# Altium schematic sheet USB_FTDI.SchDoc
size A2; SheetNumber: 9; SheetTotal: 14
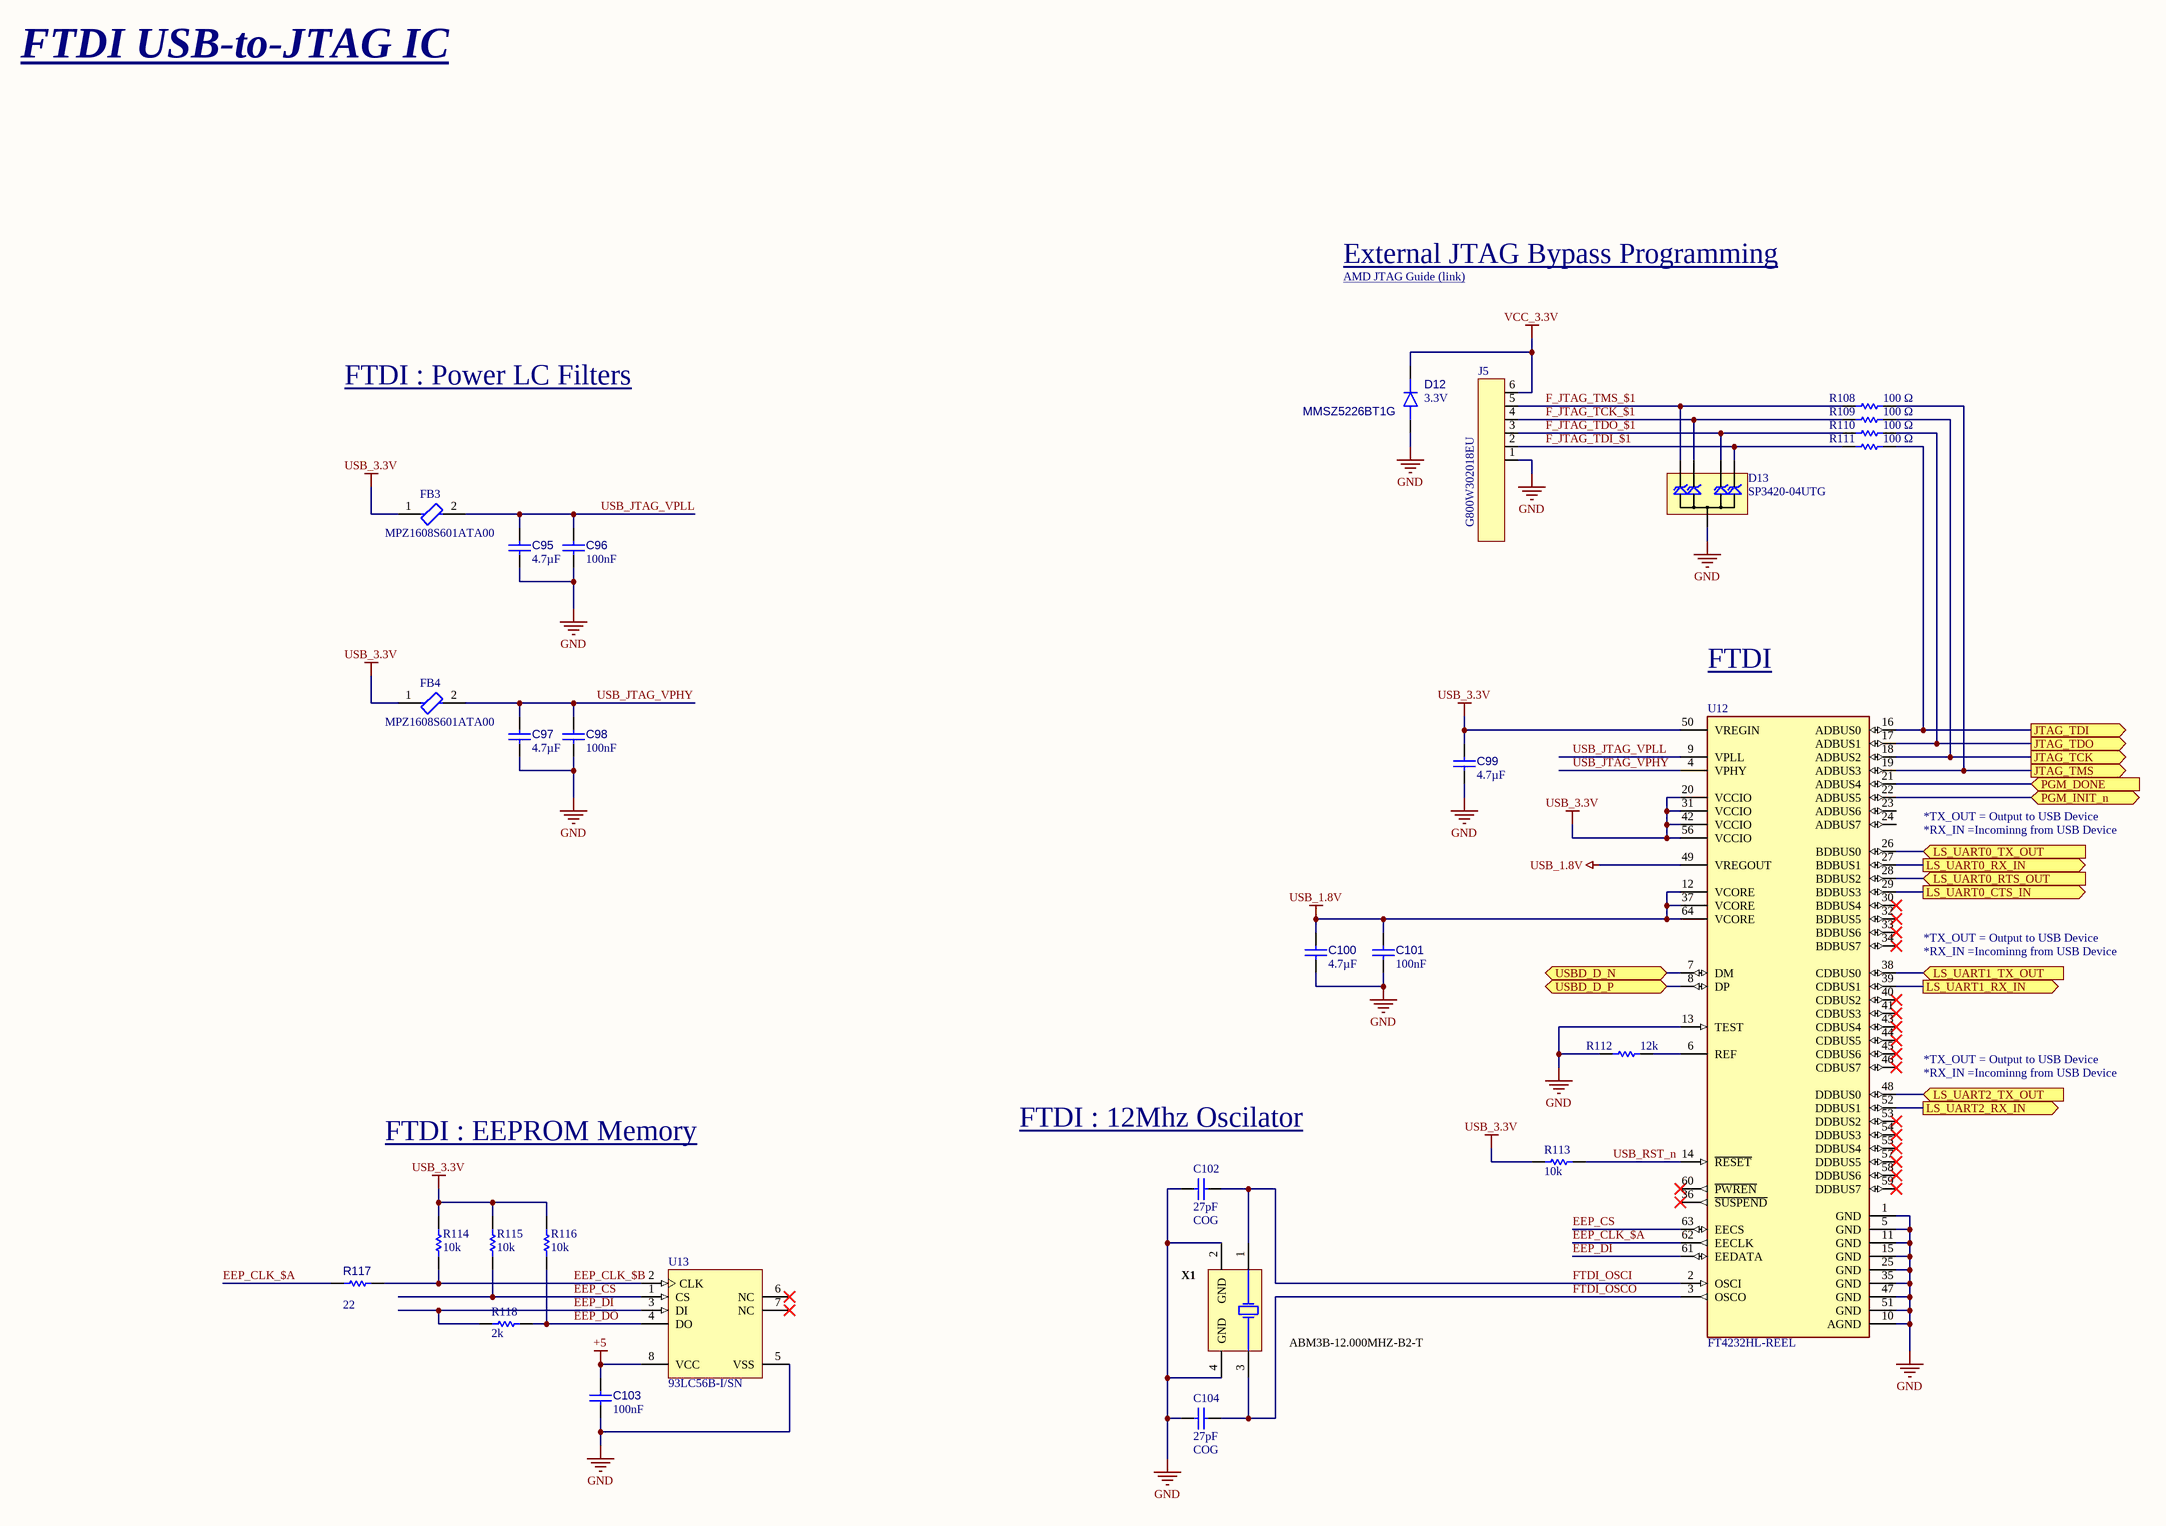
[diagram p0: USB_FTDI.SchDoc]

## Parts
C95  value 4.7µF  [CAPC0603(1608)100_L]  (hidden comment: Capacitor 4.7µF +/-20% 10V 0603)
C96  value 100nF  [CAPC1005X56X25LL10T15]  (hidden comment: Capacitor 0.1 uF +/- 5% 16 V 0402)
C97  value 4.7µF  [CAPC0603(1608)100_L]  (hidden comment: Capacitor 4.7µF +/-20% 10V 0603)
C98  value 100nF  [CAPC1005X56X25LL10T15]  (hidden comment: Capacitor 0.1 uF +/- 5% 16 V 0402)
C99  value 4.7µF  [CAPC0603(1608)100_L]  (hidden comment: Capacitor 4.7µF +/-20% 10V 0603)
C100  value 4.7µF  [CAPC0603(1608)100_L]  (hidden comment: Capacitor 4.7µF +/-20% 10V 0603)
C101  value 100nF  [CAPC1005X56X25LL10T15]  (hidden comment: Capacitor 0.1 uF +/- 5% 16 V 0402)
C102  value 27pF  Capacitor Material Type: COG  [FP-C0402-BB-MFG]  (hidden comment: C0402C270F5GACTU)
C103  value 100nF  [CAPC1005X56X25LL10T15]  (hidden comment: Capacitor 0.1 uF +/- 5% 16 V 0402)
C104  value 27pF  Capacitor Material Type: COG  [FP-C0402-BB-MFG]  (hidden comment: C0402C270F5GACTU)
D12  MMSZ5226BT1G  Forward Voltage: 3.3V
D13  SP3420-04UTG  [uDFN-10]
FB3  MPZ1608S601ATA00  [FP-MPZ1608-0_8-MFG]
FB4  MPZ1608S601ATA00  [FP-MPZ1608-0_8-MFG]
J5  G800W302018EU  [G800W302018EU]
R108  value 100 Ω  [RESC1608X55X30LL15T15]  (hidden comment: ERJ-3EKF1000V)
R109  value 100 Ω  [RESC1608X55X30LL15T15]  (hidden comment: ERJ-3EKF1000V)
R110  value 100 Ω  [RESC1608X55X30LL15T15]  (hidden comment: ERJ-3EKF1000V)
R111  value 100 Ω  [RESC1608X55X30LL15T15]  (hidden comment: ERJ-3EKF1000V)
R112  value 12k  [RESC0402(1005)_L]  (hidden comment: Resistor 12K  +/-1 % 0402 63 mW)
R113  value 10k  [RESC1005X40X25ML05T05]  (hidden comment: Resistor 10k +/-1% 0402 63 mW)
R114  value 10k  [RESC1005X40X25ML05T05]  (hidden comment: Resistor 10k +/-1% 0402 63 mW)
R115  value 10k  [RESC1005X40X25ML05T05]  (hidden comment: Resistor 10k +/-1% 0402 63 mW)
R116  value 10k  [RESC1005X40X25ML05T05]  (hidden comment: Resistor 10k +/-1% 0402 63 mW)
R117  value 22  [RESC0402(1005)_L]  (hidden comment: 22R2J)
R118  value 2k  [RESC0402(1005)_L]  (hidden comment: Resistor 2K +/-5 % 0402 63 mW)
U12  FT4232HL-REEL  [FP-LQFP-64-IPC_A]
U13  93LC56B-I/SN  [SOIC-SN8_L]
X1  ABM3B-12.000MHZ-B2-T  [ABRA-ABM3B-4_V]

## Ports
JTAG_TCK (out), JTAG_TDI (out), JTAG_TDO (out), JTAG_TMS (out), LS_UART0_CTS_IN (out), LS_UART0_RTS_OUT (in), LS_UART0_RX_IN (out), LS_UART0_TX_OUT (in), LS_UART1_RX_IN (out), LS_UART1_TX_OUT (in), LS_UART2_RX_IN (out), LS_UART2_TX_OUT (in), PGM_DONE (in), PGM_INIT_n (bidir), USBD_D_N (bidir), USBD_D_P (bidir)

## Nets
+5: C103.2 U13.8(VCC)
GND: C95.1 C96.1 C97.1 C98.1 C99.1 C100.1 C101.1 C102.2 C103.1 C104.2 D12.2(A) D13.38(GND) J5.1 R112.1 U12.1(GND) U12.5(GND) U12.10(AGND) U12.11(GND) U12.13(TEST) U12.15(GND) U12.25(GND) U12.35(GND) U12.47(GND) U12.51(GND) U13.5(VSS) X1.2(GND) X1.4(GND)
USB_1.8V: C100.2 C101.2 U12.12(VCORE) U12.37(VCORE) U12.49(VREGOUT) U12.64(VCORE)
USB_3.3V: C99.2 FB3.1 FB4.1 R113.2 R114.2 R115.2 R116.2 U12.20(VCCIO) U12.31(VCCIO) U12.42(VCCIO) U12.50(VREGIN) U12.56(VCCIO)
VCC_3.3V: D12.1(K) J5.6
EEP_CLK_$A: R117.1 U12.62(EECLK)
EEP_CLK_$B: R114.1 R117.2 U13.2(CLK)
EEP_CS: R115.1 U12.63(EECS) U13.1(CS)
EEP_DI: R118.2 U12.61(EEDATA) U13.3(DI)
EEP_DO: R116.1 R118.1 U13.4(DO)
F_JTAG_TCK_$1: D13.29 J5.4 R109.1
F_JTAG_TDI_$1: D13.56 J5.2 R111.1
F_JTAG_TDO_$1: D13.47 J5.3 R110.1
F_JTAG_TMS_$1: D13.110 J5.5 R108.1
FTDI_OSCI: C102.1 U12.2(OSCI) X1.1(X1)
FTDI_OSCO: C104.1 U12.3(OSCO) X1.3(X2)
JTAG_TCK: R109.2 U12.18(ADBUS2) ; port JTAG_TCK
JTAG_TDI: R111.2 U12.16(ADBUS0) ; port JTAG_TDI
JTAG_TDO: R110.2 U12.17(ADBUS1) ; port JTAG_TDO
JTAG_TMS: R108.2 U12.19(ADBUS3) ; port JTAG_TMS
LS_UART0_CTS_IN: U12.29(BDBUS3) ; port LS_UART0_CTS_IN
LS_UART0_RTS_OUT: U12.28(BDBUS2) ; port LS_UART0_RTS_OUT
LS_UART0_RX_IN: U12.27(BDBUS1) ; port LS_UART0_RX_IN
LS_UART0_TX_OUT: U12.26(BDBUS0) ; port LS_UART0_TX_OUT
LS_UART1_RX_IN: U12.39(CDBUS1) ; port LS_UART1_RX_IN
LS_UART1_TX_OUT: U12.38(CDBUS0) ; port LS_UART1_TX_OUT
LS_UART2_RX_IN: U12.52(DDBUS1) ; port LS_UART2_RX_IN
LS_UART2_TX_OUT: U12.48(DDBUS0) ; port LS_UART2_TX_OUT
PGM_DONE: U12.21(ADBUS4) ; port PGM_DONE
PGM_INIT_n: U12.22(ADBUS5) ; port PGM_INIT_n
USB_JTAG_VPHY: C97.2 C98.2 FB4.2 U12.4(VPHY)
USB_JTAG_VPLL: C95.2 C96.2 FB3.2 U12.9(VPLL)
USB_RST_n: R113.1 U12.14(~{RESET})
USBD_D_N: U12.7(DM) ; port USBD_D_N
USBD_D_P: U12.8(DP) ; port USBD_D_P
NetR112_2: R112.2 U12.6(REF)

Not connected (* = marked no-connect by the designer): U12 23(ADBUS6) 24(ADBUS7) 30(BDBUS4)* 32(BDBUS5)* 33(BDBUS6)* 34(BDBUS7)* 36(~{SUSPEND})* 40(CDBUS2)* 41(CDBUS3)* 43(CDBUS4)* 44(CDBUS5)* 45(CDBUS6)* 46(CDBUS7)* 53(DDBUS2)* 54(DDBUS3)* 55(DDBUS4)* 57(DDBUS5)* 58(DDBUS6)* 59(DDBUS7)* 60(~{PWREN})*; U13 6(NC)* 7(NC)*

## Notes on the sheet
- FTDI USB-to-JTAG IC
- External JTAG Bypass Programming
- AMD JTAG Guide (link) <https://docs.amd.com/r/en-US/ug1514-smartlynq-plus-module/JTAG-Target-Interface>
- FTDI : Power LC Filters
- FTDI
- *RX_IN =Incominng from USB Device
- *TX_OUT = Output to USB Device
- FTDI : EEPROM Memory
- FTDI : 12Mhz Oscilator

## Library data of the parts
C95 C97 C99 C100 = CMP-001-00076-5: Chip Capacitor, 4.7µF +/-20%, 10V, 0603, Thickness 1 mm; Tolerance: 10%; Max Operating Temperature: 85°C; Min Operating Temperature: -55°C; Voltage Rating: 10V; Pins: 2; Mounting Technology: SMT; Case/Package: 0603
C96 C98 C101 C103 = CMP-001-00001-7: Chip Capacitor, 0.1 uF, +/- 5%, 16 V, 0402 (1005 Metric); Capacitor Type: Ceramic; Voltage Rating: 16V; Pins: 2; Tolerance: 5%; Case/Package: 0402; Max Operating Temperature: 125°C; RoHS Compliant: True; Mounting Technology: SM; Min Operating Temperature: -55°C
C102 C104 = CMP-001-00104-1: Ceramic Capacitor, Multilayer, Ceramic, 50V, 1% +Tol, 1% -Tol, C0G, 30ppm/Cel TC, 0.000027uF, Surface Mount, 0402; Max Operating Temperature: 125°C; Capacitor Type: Ceramic; Min Operating Temperature: -55°C; Pins: 2; RoHS Compliant: Yes; Mounting Technology: Surface Mount; Case/Package: 0402; ComponentLink1Description: Capacitor Type; ComponentLink1URL: COG
D12 = CMP-004-00034-1: Zener Diode, 3.3V V(Z), 5%, 0.5W, Silicon, Unidirectional; Min Operating Temperature: -55°C; Max Operating Temperature: 150°C; Pins: 2; RoHS Compliant: Yes
D13 = CMP-004-00047-1: TVS Diode Array Low Capacitance ESD Protection 4-Channel (Vwork=3V3, Vclamp=6V); Manufacturer: Littelfuse; Design Item ID: SP3420-04UTG; Manufacturer Part Number: SP3420-04UTG; Source: Schematic-Lib-PhilsLab.SchLib
FB3 FB4 = CMP-08257-000179-1: Power line Ferrite Bead 600Ω @ 100MHz 1A DCR 0.15Ω SMD 0603; Impedance: 600R; DC Resistance (DCR): 150mR; Tolerance: 25%; Depth: 0.8mm; Packaging: Tape and Reel; Package Quantity: 4000; Height: 0.8mm; Length: 0.063inch; Series: MPZ; Weight: 7.1E-05oz; Width: 0.8mm; Mount: Surface Mount; Case Code (Imperial): 0603; Case/Package: 0603; Max Operating Temperature: 125°C; Max DC Current: 1A; Test Frequency: 100MHz; Min Operating Temperature: -55°C; Current Rating: 1A; Core Material: Ferrite; RoHS Compliant: Yes; REACH SVHC: No SVHC; Case Code (Metric): 1608; Termination: SMD/SMT; Lead Free: Lead Free
J5 = CMP-002-00119-1: Pin Header 6 Position 2.54mm Pitch; Manufacturer: Amphenol; Design Item ID: G800W302018EU; Source: Schematic-Lib-PhilsLab.SchLib; Manufacturer Part Number: G800W302018EU
R108-R111 = CMP-2000-00179-1: Manufacturer: Panasonic; Part Number: ERJ-3EKF1000V
R112 = CMP-009-00173-4: Chip Resistor, 12 kOhms, +/-1 %, 63 mW, -55 to 155 degC, 0402; Power: 63mW; Tolerance: 1%; Pins: 2; Max Operating Temperature: 155°C; Min Operating Temperature: -55°C; Case/Package: 0402
R113 = CMP-009-00019-7: Chip Resistor, 10 KOhm, +/- 1%, 63 mW, -55 to 155 degC, 0402 (1005 Metric); Power: 63mW; Voltage Rating: 50V; Tolerance: 1%; Mounting Technology: SM; Min Operating Temperature: -55°C; Max Operating Temperature: 155°C; Case/Package: 0402; RoHS Compliant: True; Pins: 2
R114-R116 = CMP-009-00019-6: Chip Resistor, 10 KOhm, +/- 1%, 63 mW, -55 to 155 degC, 0402 (1005 Metric); Power: 63mW; Voltage Rating: 50V; Tolerance: 1%; Mounting Technology: SM; Min Operating Temperature: -55°C; Max Operating Temperature: 155°C; Case/Package: 0402; RoHS Compliant: True; Pins: 2
R117 = CMP-009-00082-3: 22R 0.063W 5% 0402 (1005 Metric)  SMD; Power: 63mW; Tolerance: 5%; Case/Package: 0402; Pins: 2; Mounting Technology: SMT
R118 = CMP-009-00138-4: Chip Resistor, 2 kOhms, +/-5 %, 63 mW, -55 to 155 degC, 0402; Tolerance: 5%; Power: 63mW; Max Operating Temperature: 155°C; Min Operating Temperature: -55°C; Pins: 2; Case/Package: 0402
U12 = CMP-016-00010-1: Serial I/O Controller, 4 Channel(s), 1.5MBps, CMOS, PQFP64; Max Supply Voltage: 1.98V; Min Supply Voltage: 1.62V; Nominal Supply Voltage: 1.8V; RoHS Compliant: Yes; Case/Package: LFQFP; Pins: 64; Min Operating Temperature: -40°C; Max Operating Temperature: 85°C
U13 = CMP-0162-00077-1: 2K, 128x16-bit, 2.5V Microwire Serial EEPROM, 8-Pin SOIC 150mil, Industrial Temperature; Code_IPC: SOIC127P600-8; PackageVersion: revBB, Aug-2009; PackageDescription: 8-Lead Plastic Small Outline (SN) - Narrow, 3.90mm Body [SOIC]; DatasheetVersion: revF, May-2008; PackageReference: SOIC-SN8; Code_JEDEC: MS-012; ComponentLink1Description: Datasheet URL; ComponentLink1URL: https://ww1.microchip.com/downloads/en/DeviceDoc/21794G.pdf
X1 = CMP-003-00015-2: Ceramic SMD Crystal, 12 MHz, +/- 20 ppm, 18 pF, -20 to 70 degC, 4-Pin SMD, RoHS, Tape and Reel; Manufacturer: Abracon; ESR: 70; Load Capacitance: 18pF; Tolerance: 20ppm; Frequency: 12MHz; Resistance: 70Ohm; Mounting Technology: SM; Packaging: TapeandReel; Datasheet URL: http://www.abracon.com/Resonators/abm3b.pdf; Manufacturer URL: http://www.abracon.com/; RoHS Compliant: True; Frequency Tolerance: 20ppm; Datasheet Version: Aug-15; Max Operating Temperature: 70°C; Package Reference: ABM3B; Min Operating Temperature: -20°C; Pins: 4; Package Quantity: 1000; Package Description: 4-Pin Surface Mount Device, Body 5 x 3.2 mm; Case/Package: CSMD